# Altium schematic sheet ArmDebuger(5-7)DAPLink_V2.SchDoc
size 393 x 241 mm
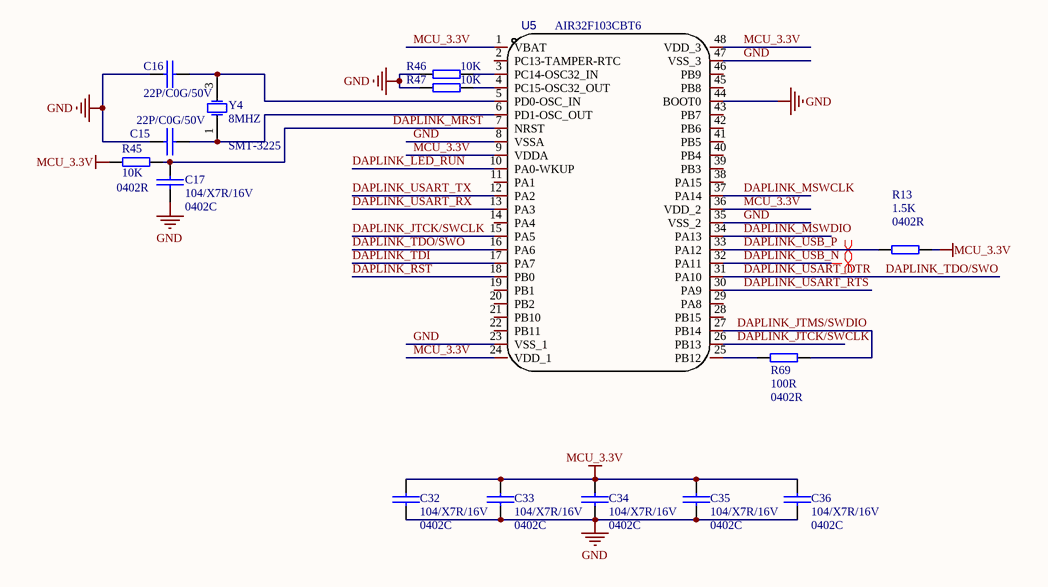
[diagram p0: ArmDebuger(5-7)DAPLink_V2.SchDoc]

## Parts
C15  22P/C0G/50V  [0402C-SMD-M]
C16  22P/C0G/50V  [0402C-SMD-M]
C17  104/X7R/16V  Fp: 0402C  [0402C-SMD-M]
C32  104/X7R/16V  Fp: 0402C  [0402C-SMD-M]
C33  104/X7R/16V  Fp: 0402C  [0402C-SMD-M]
C34  104/X7R/16V  Fp: 0402C  [0402C-SMD-M]
C35  104/X7R/16V  Fp: 0402C  [0402C-SMD-M]
C36  104/X7R/16V  Fp: 0402C  [0402C-SMD-M]
R13  1.5K  Fp: 0402R  [0402R-SMD-M]
R45  10K  Fp: 0402R  [0402R-SMD-M]
R46  10K  [0402R-SMD-M]
R47  10K  [0402R-SMD-M]
R69  100R  Fp: 0402R  [0402R-SMD-M]
U5  AIR32F103CBT6  [LQFP48_L]
Y4  8MHZ  Fp: SMT-3225  [CRYSTAL-SMT-3225]

## Nets
GND: C15.1 C16.1 C17.1 C32.1 C33.1 C34.1 C35.1 C36.1 R46.1 R47.1 U5.8(VSSA) U5.23(VSS_1) U5.35(VSS_2) U5.44(BOOT0) U5.47(VSS_3)
MCU_3.3V: C32.2 C33.2 C34.2 C35.2 C36.2 R13.1 R45.1 U5.1(VBAT) U5.9(VDDA) U5.24(VDD_1) U5.36(VDD_2) U5.48(VDD_3)
DAPLINK_JTCK/SWCLK: U5.15(PA5) U5.26(PB13)
DAPLINK_JTMS/SWDIO: R69.2 U5.27(PB14)
DAPLINK_LED_RUN: U5.10(PA0-WKUP)
DAPLINK_MRST: C17.2 R45.2 U5.7(NRST)
DAPLINK_MSWCLK: U5.37(PA14)
DAPLINK_MSWDIO: U5.34(PA13)
DAPLINK_RST: U5.18(PB0)
DAPLINK_TDI: U5.17(PA7)
DAPLINK_TDO/SWO: U5.16(PA6) U5.31(PA10)  [also labelled DAPLINK_USART_DTR]
DAPLINK_USART_RTS: U5.30(PA9)
DAPLINK_USART_RX: U5.13(PA3)
DAPLINK_USART_TX: U5.12(PA2)
DAPLINK_USB_N: U5.32(PA11)
DAPLINK_USB_P: R13.2 U5.33(PA12)
NetC15_2: C15.2 U5.6(PD1-OSC_OUT) Y4.1(OSC1)
NetC16_2: C16.2 U5.5(PD0-OSC_IN) Y4.3(OSC2)
NetR46_2: R46.2 U5.3(PC14-OSC32_IN)
NetR47_2: R47.2 U5.4(PC15-OSC32_OUT)
NetR69_1: R69.1 U5.25(PB12)

Not connected (* = marked no-connect by the designer): U5 2(PC13-TAMPER-RTC) 11(PA1) 14(PA4) 19(PB1) 20(PB2) 21(PB10) 22(PB11) 28(PB15) 29(PA8) 38(PA15) 39(PB3) 40(PB4) 41(PB5) 42(PB6) 43(PB7) 45(PB8) 46(PB9)

## Layout directives
differential pair: DAPLINK_USB_N, DAPLINK_USB_P

## Library data of the parts
C15 C16 = CAP: Fp: 0402C; P/N: 06076; LCSC: C167428
C17 C32-C36 = CAP: P/N: 06075; LCSC: C60474
R13 = RES: P/N: 04163; LCSC: C25867
R45 = RES: P/N: 04120; LCSC: C25744
R46 R47 = RES: Fp: 0402R; P/N: 04120; LCSC: C25744
R69 = RES: P/N: 04154; LCSC: C106232
U5 = STM32F103C8T6TR: Fp: LQFP48; P/N: ?; taobao: https://m.tb.cn/h.5TjcyDk?tk=32YdWb073vn
Y4 = SMD-3225_4P  25MHZ 12PF 10PPM: 贴片晶振; LCSC: C5308002; P/N: ?